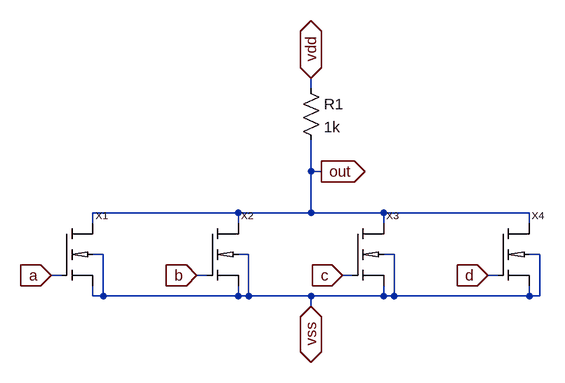
[diagram p0: schematic 4_way_nor.asc]
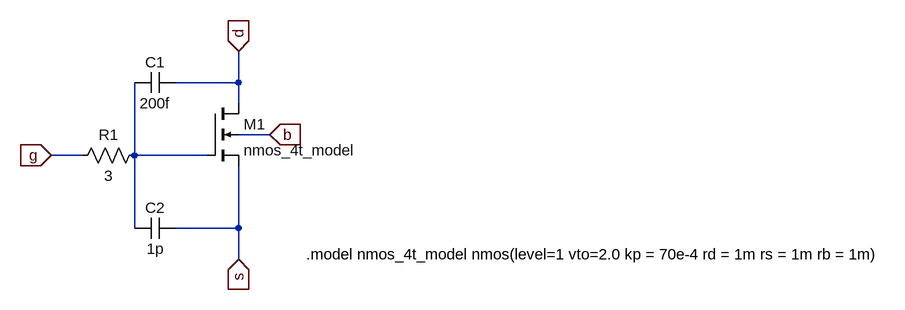
[diagram p1: sub-circuit nmos_4t.asc]
4_way_nor.asc, the LTspice schematic file:
Version 4
SHEET 1 1112 680
WIRE 464 208 464 192
WIRE 464 336 464 288
WIRE 480 336 464 336
WIRE 352 400 128 400
WIRE 464 400 464 336
WIRE 464 400 352 400
WIRE 576 400 464 400
WIRE 800 400 576 400
WIRE 128 416 128 400
WIRE 352 416 352 400
WIRE 576 416 576 400
WIRE 800 416 800 400
WIRE 144 464 128 464
WIRE 368 464 352 464
WIRE 592 464 576 464
WIRE 816 464 800 464
WIRE 80 496 64 496
WIRE 304 496 288 496
WIRE 528 496 512 496
WIRE 752 496 736 496
WIRE 128 528 128 512
WIRE 144 528 144 464
WIRE 144 528 128 528
WIRE 352 528 352 512
WIRE 352 528 144 528
WIRE 368 528 368 464
WIRE 368 528 352 528
WIRE 464 528 368 528
WIRE 576 528 576 512
WIRE 576 528 464 528
WIRE 592 528 592 464
WIRE 592 528 576 528
WIRE 800 528 800 512
WIRE 800 528 592 528
WIRE 816 528 816 464
WIRE 816 528 800 528
WIRE 464 544 464 528
FLAG 464 192 vdd
IOPIN 464 192 BiDir
FLAG 464 544 vss
IOPIN 464 544 BiDir
FLAG 288 496 b
IOPIN 288 496 In
FLAG 64 496 a
IOPIN 64 496 In
FLAG 736 496 d
IOPIN 736 496 In
FLAG 512 496 c
IOPIN 512 496 In
FLAG 480 336 out
IOPIN 480 336 Out
SYMBOL res 448 192 R0
SYMATTR InstName R1
SYMATTR Value 1k
SYMBOL nmos_4t 80 416 R0
SYMATTR InstName X1
SYMBOL nmos_4t 304 416 R0
SYMATTR InstName X2
SYMBOL nmos_4t 528 416 R0
SYMATTR InstName X3
SYMBOL nmos_4t 752 416 R0
SYMATTR InstName X4

nmos_4t.asc, the sub-circuit schematic file:
Version 4
SHEET 1 880 680
WIRE -288 -224 -288 -272
WIRE -288 -224 -384 -224
WIRE -288 -192 -288 -224
WIRE -240 -144 -288 -144
WIRE -528 -112 -576 -112
WIRE -448 -112 -448 -224
WIRE -336 -112 -448 -112
WIRE -448 0 -448 -112
WIRE -288 0 -288 -96
WIRE -288 0 -384 0
WIRE -288 48 -288 0
FLAG -576 -112 g
IOPIN -576 -112 In
FLAG -288 -272 d
IOPIN -288 -272 In
FLAG -288 48 s
IOPIN -288 48 In
FLAG -240 -144 b
IOPIN -240 -144 In
SYMBOL nmos4 -336 -192 R0
SYMATTR InstName M1
SYMATTR Value nmos_4t_model
SYMBOL cap -384 -240 R90
WINDOW 0 0 32 VBottom 2
WINDOW 3 32 32 VTop 2
SYMATTR InstName C1
SYMATTR Value 200f
SYMBOL cap -384 -16 R90
WINDOW 0 0 32 VBottom 2
WINDOW 3 32 32 VTop 2
SYMATTR InstName C2
SYMATTR Value 1p
SYMBOL res -432 -128 R90
WINDOW 0 0 56 VBottom 2
WINDOW 3 32 56 VTop 2
SYMATTR InstName R1
SYMATTR Value 3
TEXT -184 40 Left 2 !.model nmos_4t_model nmos(level=1 vto=2.0 kp = 70e-4 rd = 1m rs = 1m rb = 1m)

The netlist it stands for:
* 4_way_nor.asc
R1 vdd out 1k
XX1 out a vss vss nmos_4t
XX2 out b vss vss nmos_4t
XX3 out c vss vss nmos_4t
XX4 out d vss vss nmos_4t

* block symbol definitions
.subckt nmos_4t D G S B
M1 d N001 s b nmos_4t_model
C1 d N001 200f
C2 s N001 1p
R1 N001 g 3
.model nmos_4t_model nmos(level=1 vto=2.0 kp = 70e-4 rd = 1m rs = 1m rb = 1m)
.ends nmos_4t

.model NMOS NMOS
.model PMOS PMOS
.lib standard.mos
.backanno
.end